# EAGLE design pio8 (EAGLE 6.5.0)
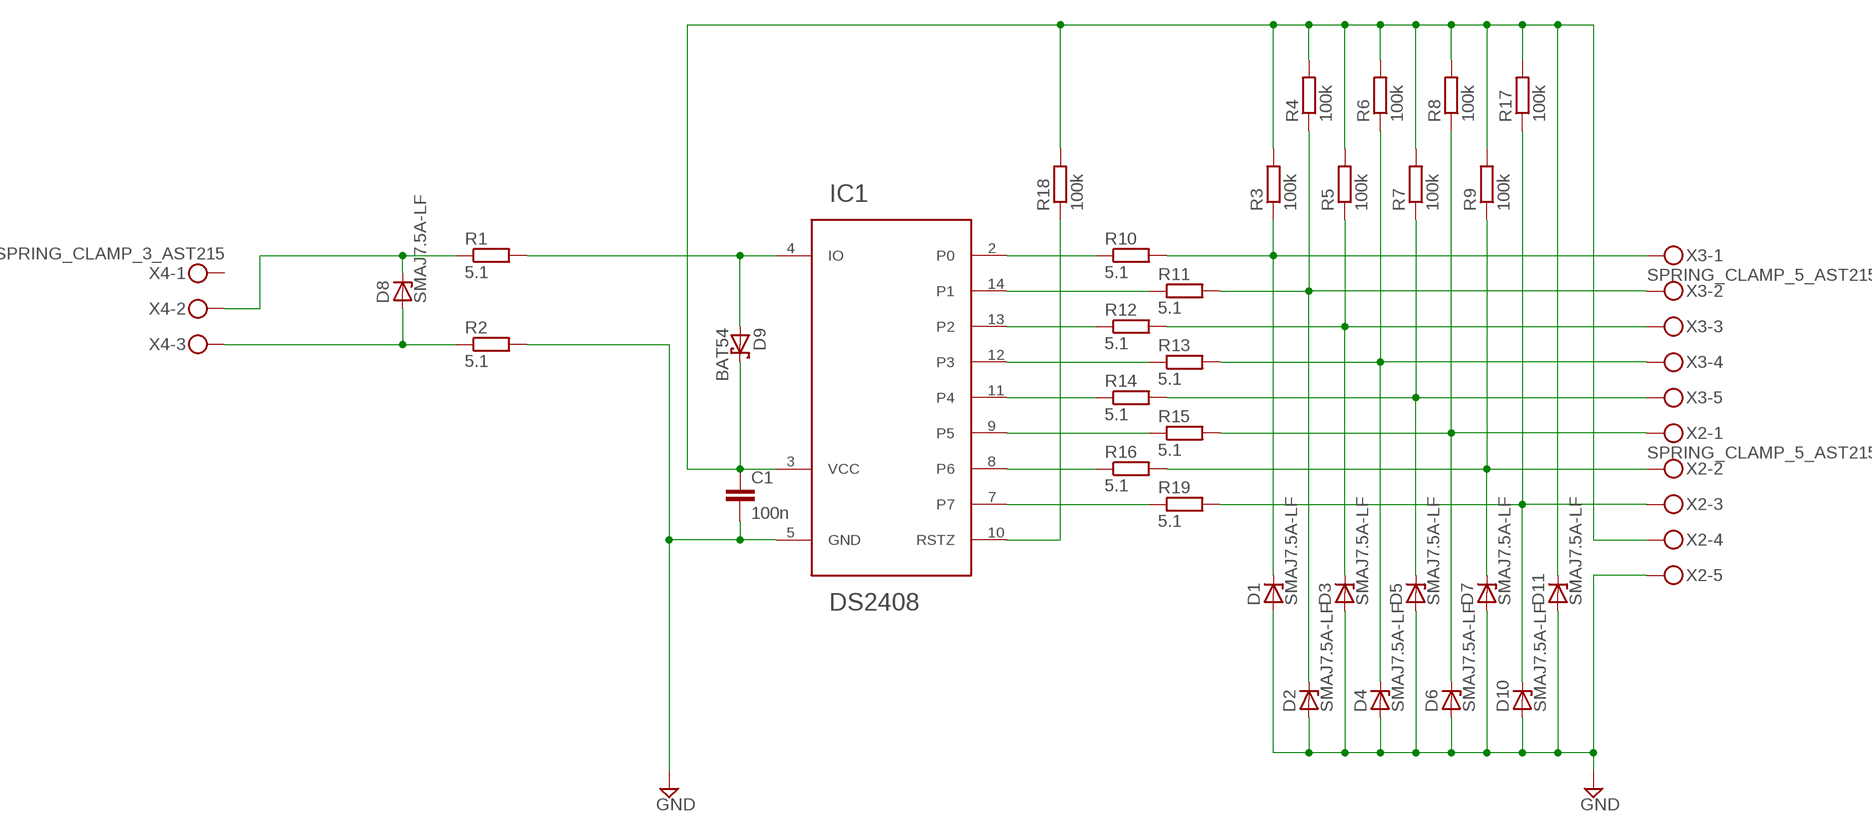
[diagram p0: schematic, sheet 1]

## Parts
C1  100n  C-EUC0402K  [C0402K]
D1  SMAJ7.5A-LF  ZENER  [DO214AC]
D2  SMAJ7.5A-LF  ZENER  [DO214AC]
D3  SMAJ7.5A-LF  ZENER  [DO214AC]
D4  SMAJ7.5A-LF  ZENER  [DO214AC]
D5  SMAJ7.5A-LF  ZENER  [DO214AC]
D6  SMAJ7.5A-LF  ZENER  [DO214AC]
D7  SMAJ7.5A-LF  ZENER  [DO214AC]
D8  SMAJ7.5A-LF  ZENER  [DO214AC]
D9  BAT54  [SOT23]
D10  SMAJ7.5A-LF  ZENER  [DO214AC]
D11  SMAJ7.5A-LF  ZENER  [DO214AC]
IC1  DS2408  [SO16]
R1  5.1  R-EU_R0402  [R0402]
R2  5.1  R-EU_R0402  [R0402]
R3  100k  R-EU_R0402  [R0402]
R4  100k  R-EU_R0402  [R0402]
R5  100k  R-EU_R0402  [R0402]
R6  100k  R-EU_R0402  [R0402]
R7  100k  R-EU_R0402  [R0402]
R8  100k  R-EU_R0402  [R0402]
R9  100k  R-EU_R0402  [R0402]
R10  5.1  R-EU_R0402  [R0402]
R11  5.1  R-EU_R0402  [R0402]
R12  5.1  R-EU_R0402  [R0402]
R13  5.1  R-EU_R0402  [R0402]
R14  5.1  R-EU_R0402  [R0402]
R15  5.1  R-EU_R0402  [R0402]
R16  5.1  R-EU_R0402  [R0402]
R17  100k  R-EU_R0402  [R0402]
R18  100k  R-EU_R0402  [R0402]
R19  5.1  R-EU_R0402  [R0402]
X2  SPRING_CLAMP_5_AST215  [AST215_5]
X3  SPRING_CLAMP_5_AST215  [AST215_5]
X4  SPRING_CLAMP_3_AST215  [AST215_3]

## Nets
GND: C1.2 D1.A D2.A D3.A D4.A D5.A D6.A D7.A D10.A D11.A IC1.5(GND) R2.2 X2.5A X2.5B
N$1: D1.C R3.1 R10.2 X3.1A X3.1B
N$2: D2.C R4.1 R11.2 X3.2A X3.2B
N$3: D3.C R5.1 R12.2 X3.3A X3.3B
N$4: D4.C R6.1 R13.2 X3.4A X3.4B
N$5: D5.C R7.1 R14.2 X3.5A X3.5B
N$6: D6.C R8.1 R15.2 X2.1A X2.1B
N$7: D7.C R9.1 R16.2 X2.2A X2.2B
N$8: IC1.2(P0) R10.1
N$9: D8.A R2.1 X4.3A X4.3B
N$10: D8.C R1.1 X4.2A X4.2B
N$11: C1.1 D9.3(C) D11.C IC1.3(VCC) R3.2 R4.2 R5.2 R6.2 R7.2 R8.2 R9.2 R17.2 R18.2 X2.4A X2.4B
N$12: D10.C R17.1 R19.2 X2.3A X2.3B
N$13: IC1.14(P1) R11.1
N$14: IC1.13(P2) R12.1
N$15: IC1.12(P3) R13.1
N$16: IC1.11(P4) R14.1
N$17: IC1.9(P5) R15.1
N$18: IC1.8(P6) R16.1
N$19: IC1.7 R19.1
N$20: D9.1(A) IC1.4(IO) R1.2
N$21: IC1.10(RSTZ) R18.1
Unconnected: X4.1A X4.1B

## Library data of the parts
C1 = rcl:C-EU: CAPACITOR, European symbol
D1-D8 D10 D11 = diodes:ZENER
D9 = diode:BAT54: Schottky Diodes Source: Fairchild .. BAT54.pdf
IC1 = 1wire:DS2408
R1 R2 R10-R16 R19 = rcl:R-EU_: RESISTOR, European symbol
R3-R9 R17 R18 = resistor:R-EU_: RESISTOR, European symbol
X2 X3 = connectors:SPRING_CLAMP_5; MANF: METZ connect; MANF#: AST21505
X4 = connectors:SPRING_CLAMP_3

## Board
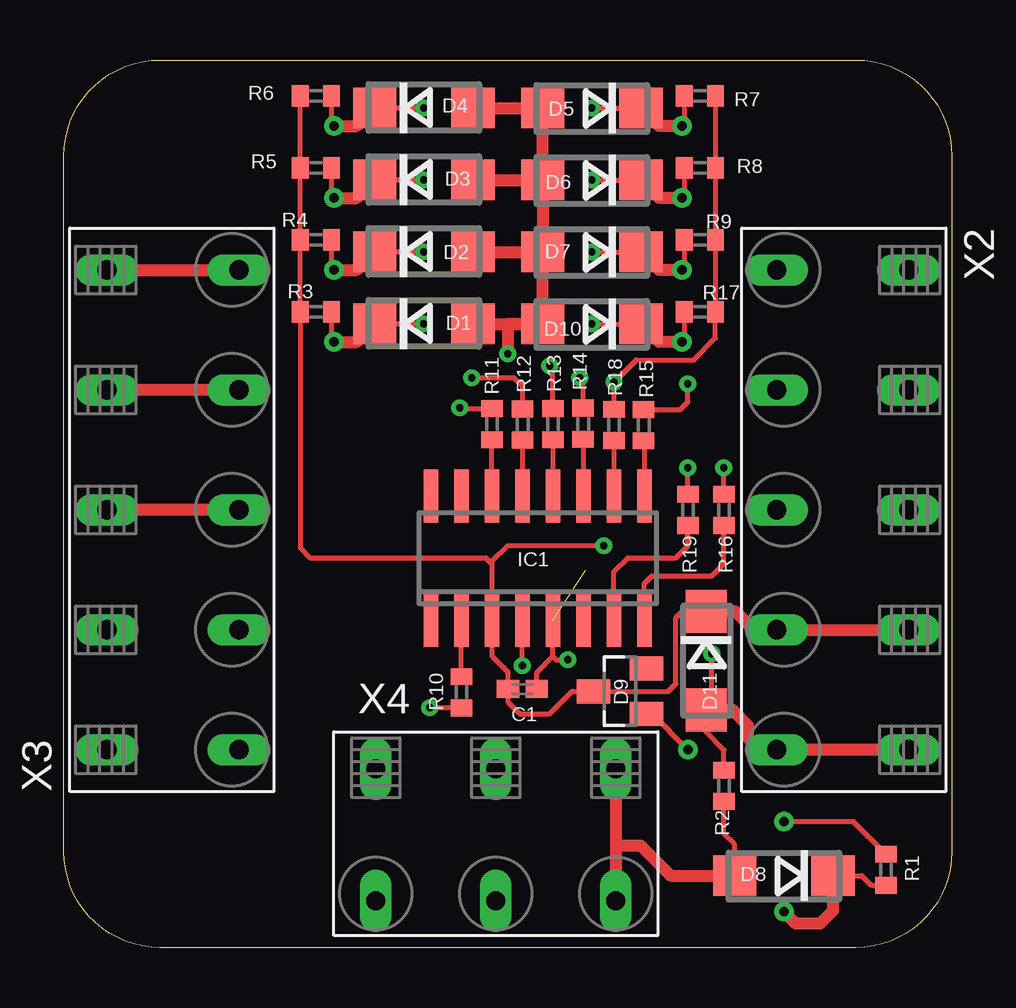
[diagram p1: board, top side]
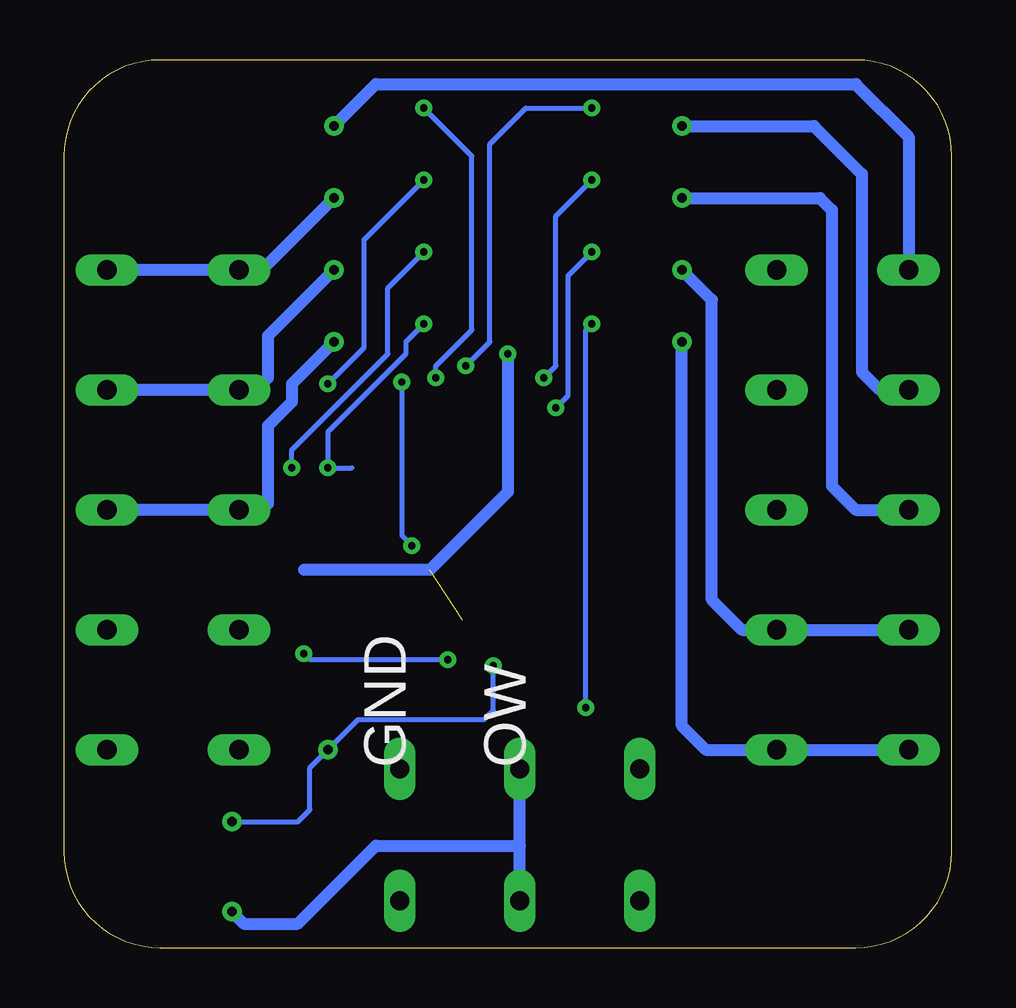
[diagram p2: board, bottom side, seen from below]

Size 37 x 37 mm. Coordinates in mm from the lower left corner, seen from the top.
Outline: 33,0 4,0 arc-90 0,4 0,33 arc-90 4,37 33,37 arc-90 37,33 37,4 arc-90 33,0
Copper layers (1*16): Top 0.035mm / dielectric 1.5mm / Bottom 0.035mm
Design rules "default *": minimum track width 0.2mm, minimum drill 0.3mm, track to track 0.2mm, track to pad 0.2mm, pad to pad 0.2mm, via to via 0.2mm, smd to smd 0.2mm, copper to edge 0.5mm, drill to drill 1mm, minimum pad ring 10mil, minimum via ring 8mil, stop-mask expansion 4mil, vias tented up to drill 0mil, thermal gap 10mil

### Footprints (pad centres in the part's own frame; a part is rotated, then mirrored left to right if it is on the bottom)
C0402K = smd 0.925 x 0.74: 1 -0.6,0; 2 0.6,0
DO214AC = smd 1.8 x 1.7: A 2.05,0; C -2.05,0
SOT23 = smd 1 x 1.4: 1 -0.95,-1.1; 2 0.95,-1.1; 3 0,1.1
SO16 = smd 2.2 x 0.6: 1 -2.6,4.445; 2 -2.6,3.175; 3 -2.6,1.905; 4 -2.6,0.635; 5 -2.6,-0.635; 6 -2.6,-1.905; 7 -2.6,-3.175; 8 -2.6,-4.445; 9 2.6,-4.445; 10 2.6,-3.175; 11 2.6,-1.905; 12 2.6,-0.635; 13 2.6,0.635; 14 2.6,1.905; 15 2.6,3.175; 16 2.6,4.445
R0402 = smd 0.7 x 0.9: 1 -0.65,0; 2 0.65,0
AST215_5 = drill 0.8 long: 1A -10,-2.8; 1B -10,2.7; 2A -5,-2.8; 2B -5,2.7; 3A 0,-2.8; 3B 0,2.7; 4A 5,-2.8; 4B 5,2.7; 5A 10,-2.8; 5B 10,2.7
AST215_3 = drill 0.8 long: 1A -5,-2.8; 1B -5,2.7; 2A 0,-2.8; 2B 0,2.7; 3A 5,-2.8; 3B 5,2.7

### Placement (x,y rotation side)
C1  19.11,10.78 0 top
D1  15,26 0 top
D2  15,29 0 top
D3  15,32 0 top
D4  15,35 0 top
D5  22,35 180 top
D6  22,32 180 top
D7  22,29 180 top
D8  30,3 180 top
D9  23.17,10.69 90 top
D10  22,26 180 top
D11  26.76,11.96 270 top
IC1  19.74,16.23 90 top
R1  34.25,3.25 90 top
R2  27.5,6.75 90 top
R3  10.5,26.5 180 top
R4  10.5,29.5 180 top
R5  10.5,32.5 180 top
R6  10.5,35.5 180 top
R7  26.5,35.5 0 top
R8  26.5,32.5 0 top
R9  26.5,29.5 0 top
R10  16.57,10.64 270 top
R11  17.84,21.82 90 top
R12  19.12,21.8 90 top
R13  20.38,21.82 90 top
R14  21.64,21.83 90 top
R15  24.16,21.77 90 top
R16  27.5,18.25 90 top
R17  26.5,26.5 0 top
R18  22.92,21.79 90 top
R19  26,18.25 90 top
X2  32.5,18.25 270 top
X3  4.5,18.25 90 top
X4  18,4.75 0 top

### Tracks (layer width: path | path; a pad name or v marks a point on that pad's centre or on a via)
GND  (via drill 0.3)  (1 unrouted)
  Top 0.2: C1.2 19.71,11.46 20.38,12.13 | 20.38,12.13 IC1.5 | R2.2 27.5,8.25 26.76,8.99 D11.A 27,10.15 v27,12.25 | 20.38,12.13 20.5,12 v21,12
  Top 0.5: D4.A D5.A D6.A | D2.A D7.A | D1.A D10.A | D10.A D7.A | D6.A D7.A | D3.A D6.A | D10.A 18.5,26 v18.5,24.75 | D11.A 27.84,9.91 28.5,9.25 28.5,8.75 29,8.25 X2.5A X2.5B
  Bottom 0.2: v21,12 26.75,12 v27,12.25
  Bottom 0.5: v18.5,24.75 18.5,19 21.75,15.75 27,15.75
N$1  (via drill 0.3, 0.4)
  Top 0.2: R10.2 v15.26,9.99 v15.25,10 | v15,26 D1.C | R3.1 11.15,25.35 v11.25,25.25
  Top 0.5: v11.25,25.25 12.2,25.25 D1.C
  Bottom 0.2: v15.25,10 15.25,25.75 v15,26
  Bottom 0.5: v11.25,25.25 11.25,9.25 10.25,8.25 X3.1A X3.1B
N$2  (via drill 0.3, 0.4)
  Top 0.2: v15,29 D2.C | v16.5,22.5 16.53,22.47 R11.2 | R4.1 11.15,28.35 v11.25,28.25
  Top 0.5: v11.25,28.25 12.2,28.25 D2.C
  Bottom 0.2: v15,29 16,28 16,23 v16.5,22.5
  Bottom 0.5: v11.25,28.25 10,27 10,14.5 8.75,13.25 X3.2A X3.2B
N$3  (via drill 0.3, 0.4)
  Top 0.2: v15,32 D3.C | R12.2 19.12,23.38 18.75,23.75 v17,23.75 | R5.1 11.15,31.35 v11.25,31.25
  Top 0.5: v11.25,31.25 12.2,31.25 D3.C | X3.3A X3.3B
  Bottom 0.2: v17,23.75 16.5,24.25 16.5,30.5 v15,32
  Bottom 0.5: v11.25,31.25 5.5,31.25 5,30.75 5,19.25 4,18.25 X3.3B
N$4  (via drill 0.3, 0.4)
  Top 0.2: v15,35 D4.C | R13.2 20.38,24.12 v20.25,24.25 | R6.1 11.15,34.35 v11.25,34.25
  Top 0.5: v11.25,34.25 12.2,34.25 D4.C | X3.4A X3.4B
  Bottom 0.2: v20.25,24.25 19.25,25.25 19.25,33.5 17.75,35 v15,35
  Bottom 0.5: v11.25,34.25 5.75,34.25 3.75,32.25 3.75,24 3,23.25 X3.4B
N$5  (via drill 0.3, 0.4)
  Top 0.2: v22,35 D5.C | R14.2 21.64,23.61 v21.5,23.75 | R7.1 25.85,34.35 v25.75,34.25
  Top 0.5: v25.75,34.25 24.8,34.25 D5.C | X3.5B X3.5A
  Bottom 0.2: v21.5,23.75 21.5,24.25 20,25.75 20,33 v22,35
  Bottom 0.5: v25.75,34.25 24,36 4,36 1.8,33.8 X3.5B
N$6  (via drill 0.3, 0.4)
  Top 0.2: v22,32 D6.C | R8.1 25.85,31.35 v25.75,31.25 | R15.2 25.67,22.42 26,22.75 v26,23.5
  Top 0.5: v25.75,31.25 24.8,31.25 D6.C
  Bottom 0.2: v22,32 24.5,29.5 24.5,25 v26,23.5
  Bottom 0.5: v25.75,31.25 28.75,28.25 X2.1A X2.1B
N$7  (via drill 0.3, 0.4)
  Top 0.2: R16.2 v27.5,20 | v22,29 D7.C | R9.1 25.85,28.35 v25.75,28.25
  Top 0.5: v25.75,28.25 24.8,28.25 D7.C
  Bottom 0.2: v27.5,20 27.5,20.75 23.5,24.75 23.5,27.5 v22,29
  Bottom 0.5: v25.75,28.25 28.5,25.5 28.5,23.75 29,23.25 X2.2A X2.2B
N$8
  Top 0.2: R10.1 IC1.2
N$9
  Top 0.2: D8.A 27.95,4.3 27.5,4.75 R2.1
  Top 0.5: D8.A 25.28,3 24.03,4.25 23,4.25 | X4.3B 23,4.25 | 23,4.25 X4.3A
N$10  (via drill 0.4)
  Top 0.2: D8.C 33.25,3 33.65,2.6 R1.1
  Top 0.5: D8.C 32.05,1.55 31.5,1 30.5,1 v30,1.5
  Bottom 0.5: v30,1.5 29.5,1 27.25,1 24,4.25 18,4.25 | 18,4.25 X4.2B | X4.2A 18,4.25
N$11  (via drill 0.3)
  Top 0.2: D11.C 25.76,14.01 25.5,13.75 25.5,11 25.19,10.69 D9.3 21.19,10.69 20.25,9.75 19,9.75 18.5,10.25 C1.1 18.5,11.5 17.84,12.16 IC1.3 17.84,16 | R6.2 R5.2 R4.2 R3.2 9.85,16.65 10.25,16.25 17.59,16.25 17.84,16 | R7.2 R8.2 R9.2 R17.2 27.15,25.4 26.25,24.5 23.84,24.5 v22.92,23.58 R18.2 | v22.5,16.75 18.5,16.75 17.84,16.09 17.84,16
  Top 0.5: X2.4B X2.4A 28.75,13.25 27.99,14.01 D11.C
  Bottom 0.2: v22.92,23.58 22.92,17.17 v22.5,16.75
N$12  (via drill 0.3, 0.4)
  Top 0.2: R19.2 v26,20 | v22,26 D10.C | R17.1 25.85,25.35 v25.75,25.25
  Top 0.5: v25.75,25.25 24.8,25.25 D10.C
  Bottom 0.2: 25,20 v26,20 26,21.5 22.75,24.75 22.75,25.25 v22,26
  Bottom 0.5: v25.75,25.25 27.5,23.5 27.5,22.75 28.5,21.75 28.5,18.5 28.75,18.25 X2.3A X2.3B
N$13
  Top 0.2: IC1.14 R11.1
N$14
  Top 0.2: R12.1 19.11,21.14 IC1.13
N$15
  Top 0.2: R13.1 IC1.12
N$16
  Top 0.2: R14.1 IC1.11
N$17
  Top 0.2: R15.1 24.19,21.09 IC1.9
N$18
  Top 0.2: IC1.8 24.19,15.19 24.5,15.5 27,15.5 27.5,16 R16.1
N$19
  Top 0.2: IC1.7 22.92,15.67 23.5,16.25 25.5,16.25 26,16.75 R19.1
N$20  (via drill 0.3, 0.4)
  Top 0.2: R1.2 32.9,5.25 v30,5.25 | v19.11,11.75 IC1.4 | v26,8.25 24.51,9.74 D9.1
  Bottom 0.2: v30,5.25 27.25,5.25 26.75,5.75 26.75,7.5 v26,8.25 24.75,9.5 19.5,9.5 19.11,9.89 v19.11,11.75
N$21
  Top 0.2: R18.1 IC1.10

### Text on the board
bPlace: OW | GND